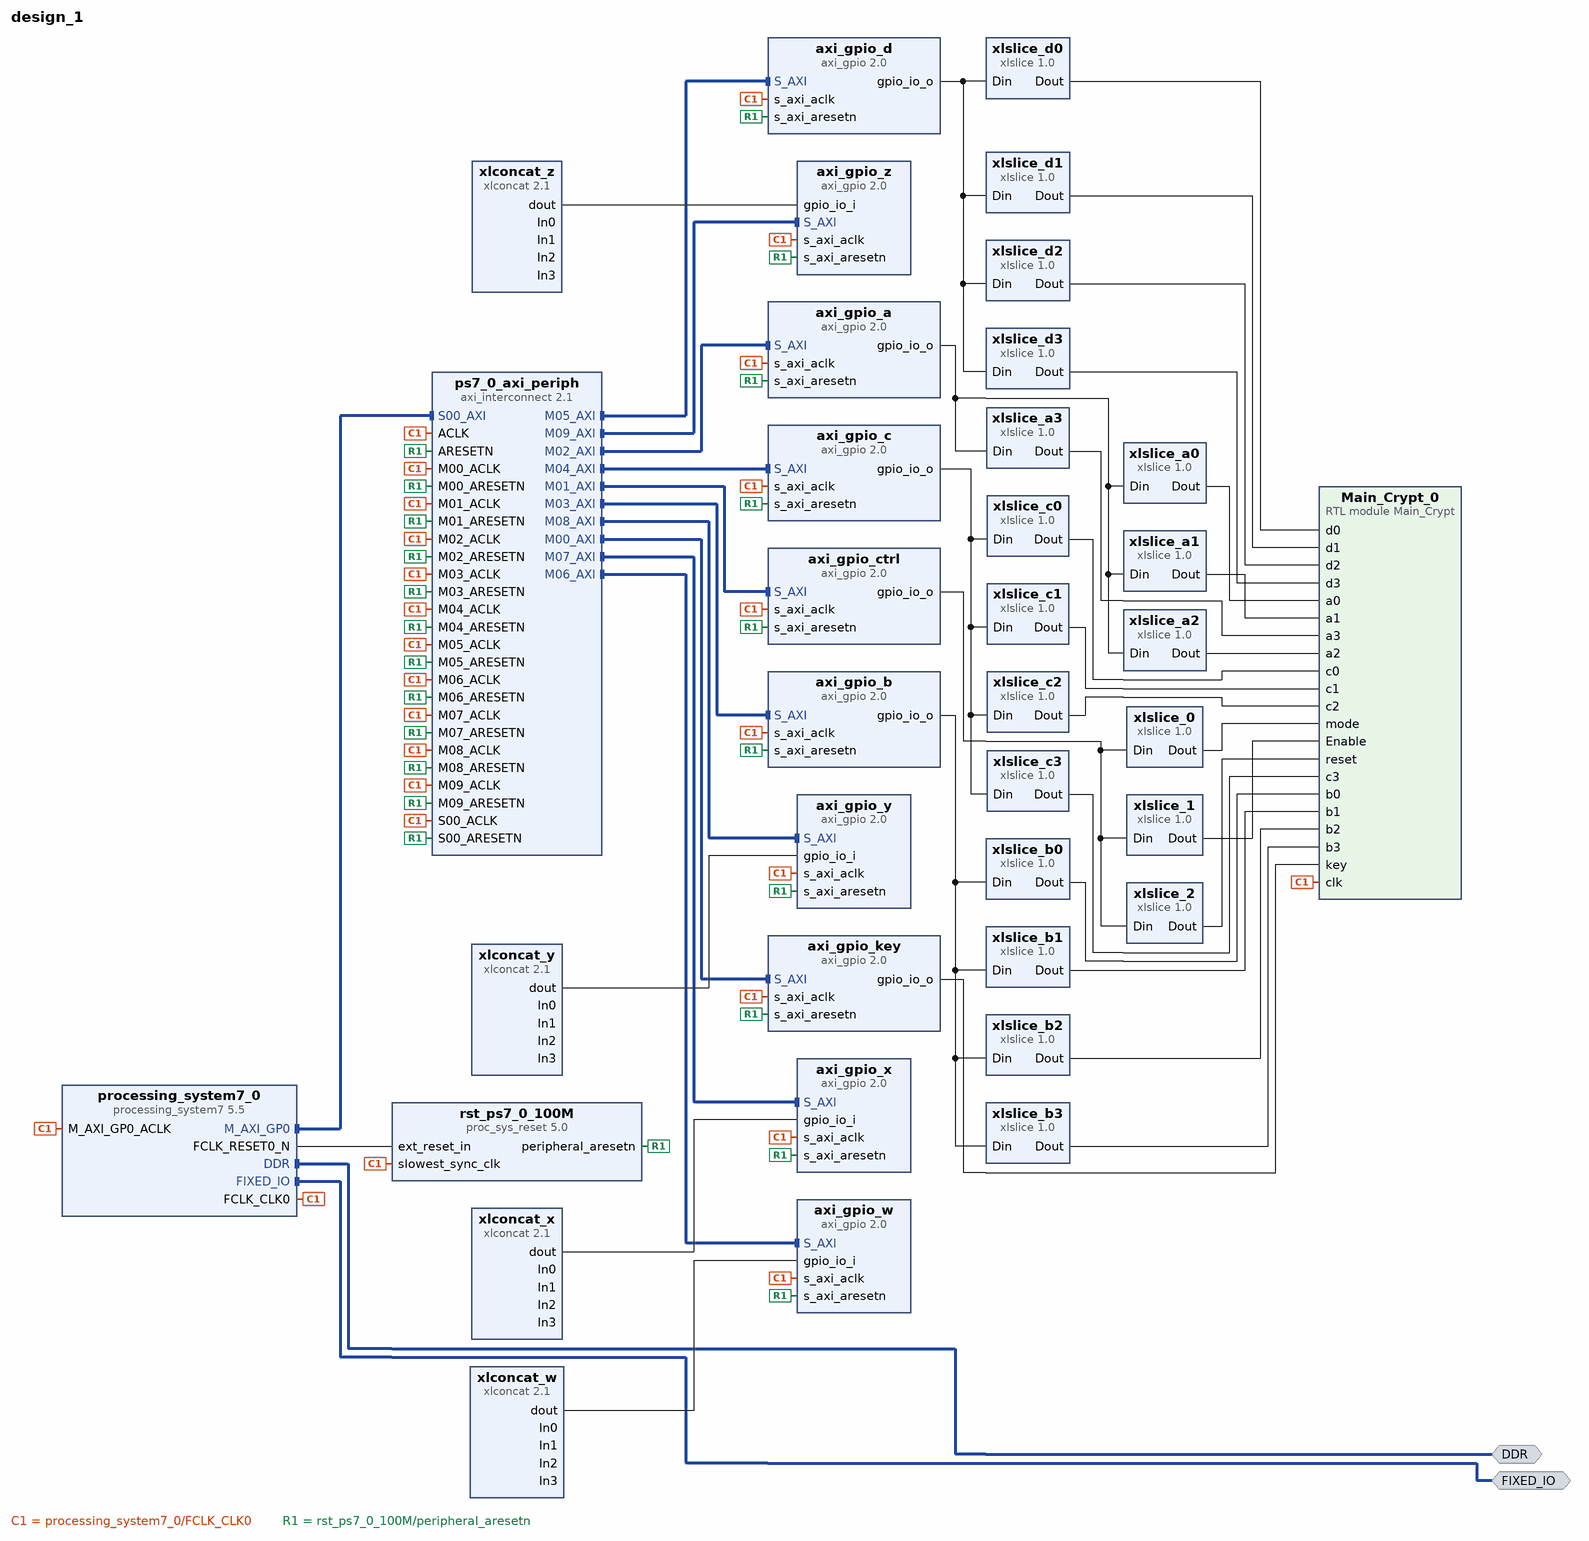
[diagram p0: block diagram of the top level]
# Vivado block design design_1, xc7z020clg400-1, Vivado 2022.1
create_bd_design design_1

create_bd_intf_port -mode Master -vlnv xilinx.com:interface:ddrx_rtl:1.0 DDR
create_bd_intf_port -mode Master -vlnv xilinx.com:display_processing_system7:fixedio_rtl:1.0 FIXED_IO

create_bd_cell -type ip -vlnv xilinx.com:ip:processing_system7:5.5 processing_system7_0
set_property -dict [list \
  CONFIG.PCW_APU_PERIPHERAL_FREQMHZ 650 \
  CONFIG.PCW_CRYSTAL_PERIPHERAL_FREQMHZ 50 \
  CONFIG.PCW_ENET0_ENET0_IO {MIO 16 .. 27} \
  CONFIG.PCW_ENET0_GRP_MDIO_ENABLE 1 \
  CONFIG.PCW_ENET0_GRP_MDIO_IO {MIO 52 .. 53} \
  CONFIG.PCW_ENET0_PERIPHERAL_ENABLE 1 \
  CONFIG.PCW_ENET0_RESET_ENABLE 1 \
  CONFIG.PCW_ENET0_RESET_IO {MIO 9} \
  CONFIG.PCW_ENET_RESET_ENABLE 1 \
  CONFIG.PCW_ENET_RESET_SELECT {Share reset pin} \
  CONFIG.PCW_FPGA0_PERIPHERAL_FREQMHZ 150 \
  CONFIG.PCW_FPGA1_PERIPHERAL_FREQMHZ 50 \
  CONFIG.PCW_GPIO_EMIO_GPIO_ENABLE 1 \
  CONFIG.PCW_GPIO_EMIO_GPIO_IO 29 \
  CONFIG.PCW_GPIO_EMIO_GPIO_WIDTH 29 \
  CONFIG.PCW_GPIO_MIO_GPIO_ENABLE 1 \
  CONFIG.PCW_GPIO_MIO_GPIO_IO MIO \
  CONFIG.PCW_I2C_RESET_ENABLE 1 \
  CONFIG.PCW_M_AXI_GP0_FREQMHZ 10 \
  CONFIG.PCW_PERIPHERAL_BOARD_PRESET part0 \
  CONFIG.PCW_PRESET_BANK1_VOLTAGE {LVCMOS 1.8V} \
  CONFIG.PCW_QSPI_GRP_FBCLK_ENABLE 1 \
  CONFIG.PCW_QSPI_GRP_FBCLK_IO {MIO 8} \
  CONFIG.PCW_QSPI_GRP_SINGLE_SS_ENABLE 1 \
  CONFIG.PCW_QSPI_GRP_SINGLE_SS_IO {MIO 1 .. 6} \
  CONFIG.PCW_QSPI_PERIPHERAL_ENABLE 1 \
  CONFIG.PCW_QSPI_QSPI_IO {MIO 1 .. 6} \
  CONFIG.PCW_SD0_GRP_CD_ENABLE 1 \
  CONFIG.PCW_SD0_GRP_CD_IO {MIO 47} \
  CONFIG.PCW_SD0_GRP_WP_ENABLE 0 \
  CONFIG.PCW_SD0_PERIPHERAL_ENABLE 1 \
  CONFIG.PCW_SD0_SD0_IO {MIO 40 .. 45} \
  CONFIG.PCW_SDIO_PERIPHERAL_FREQMHZ 50 \
  CONFIG.PCW_SINGLE_QSPI_DATA_MODE x4 \
  CONFIG.PCW_UART0_PERIPHERAL_ENABLE 1 \
  CONFIG.PCW_UART0_UART0_IO {MIO 14 .. 15} \
  CONFIG.PCW_UART1_PERIPHERAL_ENABLE 0 \
  CONFIG.PCW_UART_PERIPHERAL_FREQMHZ 100 \
  CONFIG.PCW_UIPARAM_DDR_BUS_WIDTH {16 Bit} \
  CONFIG.PCW_UIPARAM_DDR_FREQ_MHZ 525 \
  CONFIG.PCW_UIPARAM_DDR_PARTNO {MT41J256M16 RE-125} \
  CONFIG.PCW_USB0_PERIPHERAL_ENABLE 1 \
  CONFIG.PCW_USB0_RESET_ENABLE 1 \
  CONFIG.PCW_USB0_RESET_IO {MIO 46} \
  CONFIG.PCW_USB0_USB0_IO {MIO 28 .. 39} \
  CONFIG.PCW_USB_RESET_ENABLE 1 \
  CONFIG.PCW_USB_RESET_SELECT {Share reset pin} \
] [get_bd_cells processing_system7_0]
# 485 more settings of processing_system7_0 are not shown: defaults, MIO pin electricals, DDR timing, and values the tool derives
create_bd_cell -type ip -vlnv xilinx.com:ip:proc_sys_reset:5.0 rst_ps7_0_100M
create_bd_cell -type ip -vlnv xilinx.com:ip:axi_gpio:2.0 axi_gpio_key
set_property -dict [list \
  CONFIG.C_ALL_OUTPUTS 1 \
  CONFIG.C_GPIO_WIDTH 10 \
  CONFIG.GPIO_BOARD_INTERFACE Custom \
  CONFIG.USE_BOARD_FLOW true \
] [get_bd_cells axi_gpio_key]
create_bd_cell -type ip -vlnv xilinx.com:ip:axi_interconnect:2.1 ps7_0_axi_periph
set_property -dict {CONFIG.NUM_MI 10} [get_bd_cells ps7_0_axi_periph]
create_bd_cell -type ip -vlnv xilinx.com:ip:axi_gpio:2.0 axi_gpio_ctrl
set_property -dict {CONFIG.C_ALL_INPUTS 0 CONFIG.C_ALL_OUTPUTS 1 CONFIG.C_GPIO_WIDTH 3} [get_bd_cells axi_gpio_ctrl]
create_bd_cell -type ip -vlnv xilinx.com:ip:xlslice:1.0 xlslice_0
set_property -dict {CONFIG.DIN_FROM 2 CONFIG.DIN_TO 2 CONFIG.DIN_WIDTH 3 CONFIG.DOUT_WIDTH 1} [get_bd_cells xlslice_0]
create_bd_cell -type ip -vlnv xilinx.com:ip:xlslice:1.0 xlslice_1
set_property -dict {CONFIG.DIN_FROM 1 CONFIG.DIN_TO 1 CONFIG.DIN_WIDTH 3 CONFIG.DOUT_WIDTH 1} [get_bd_cells xlslice_1]
create_bd_cell -type ip -vlnv xilinx.com:ip:xlslice:1.0 xlslice_2
set_property -dict {CONFIG.DIN_FROM 0 CONFIG.DIN_TO 0 CONFIG.DIN_WIDTH 3 CONFIG.DOUT_WIDTH 1} [get_bd_cells xlslice_2]
create_bd_cell -type ip -vlnv xilinx.com:ip:axi_gpio:2.0 axi_gpio_a
set_property -dict {CONFIG.C_ALL_OUTPUTS 1} [get_bd_cells axi_gpio_a]
create_bd_cell -type ip -vlnv xilinx.com:ip:xlslice:1.0 xlslice_a0
set_property -dict {CONFIG.DIN_FROM 31 CONFIG.DIN_TO 24 CONFIG.DIN_WIDTH 32 CONFIG.DOUT_WIDTH 8} [get_bd_cells xlslice_a0]
create_bd_cell -type ip -vlnv xilinx.com:ip:xlslice:1.0 xlslice_a1
set_property -dict {CONFIG.DIN_FROM 23 CONFIG.DIN_TO 16 CONFIG.DIN_WIDTH 32 CONFIG.DOUT_WIDTH 8} [get_bd_cells xlslice_a1]
create_bd_cell -type ip -vlnv xilinx.com:ip:xlslice:1.0 xlslice_a2
set_property -dict {CONFIG.DIN_FROM 15 CONFIG.DIN_TO 8 CONFIG.DIN_WIDTH 32 CONFIG.DOUT_WIDTH 8} [get_bd_cells xlslice_a2]
create_bd_cell -type ip -vlnv xilinx.com:ip:xlslice:1.0 xlslice_a3
set_property -dict {CONFIG.DIN_FROM 7 CONFIG.DIN_WIDTH 32 CONFIG.DOUT_WIDTH 8} [get_bd_cells xlslice_a3]
create_bd_cell -type ip -vlnv xilinx.com:ip:axi_gpio:2.0 axi_gpio_b
set_property -dict {CONFIG.C_ALL_OUTPUTS 1} [get_bd_cells axi_gpio_b]
create_bd_cell -type ip -vlnv xilinx.com:ip:xlslice:1.0 xlslice_b3
set_property -dict {CONFIG.DIN_FROM 31 CONFIG.DIN_TO 24 CONFIG.DIN_WIDTH 32 CONFIG.DOUT_WIDTH 8} [get_bd_cells xlslice_b3]
create_bd_cell -type ip -vlnv xilinx.com:ip:xlslice:1.0 xlslice_b0
set_property -dict {CONFIG.DIN_FROM 23 CONFIG.DIN_TO 16 CONFIG.DIN_WIDTH 32 CONFIG.DOUT_WIDTH 8} [get_bd_cells xlslice_b0]
create_bd_cell -type ip -vlnv xilinx.com:ip:xlslice:1.0 xlslice_b2
set_property -dict {CONFIG.DIN_FROM 15 CONFIG.DIN_TO 8 CONFIG.DIN_WIDTH 32 CONFIG.DOUT_WIDTH 8} [get_bd_cells xlslice_b2]
create_bd_cell -type ip -vlnv xilinx.com:ip:xlslice:1.0 xlslice_b1
set_property -dict {CONFIG.DIN_FROM 7 CONFIG.DIN_WIDTH 32 CONFIG.DOUT_WIDTH 8} [get_bd_cells xlslice_b1]
create_bd_cell -type ip -vlnv xilinx.com:ip:axi_gpio:2.0 axi_gpio_c
set_property -dict {CONFIG.C_ALL_OUTPUTS 1} [get_bd_cells axi_gpio_c]
create_bd_cell -type ip -vlnv xilinx.com:ip:xlslice:1.0 xlslice_c3
set_property -dict {CONFIG.DIN_FROM 31 CONFIG.DIN_TO 24 CONFIG.DIN_WIDTH 32 CONFIG.DOUT_WIDTH 8} [get_bd_cells xlslice_c3]
create_bd_cell -type ip -vlnv xilinx.com:ip:xlslice:1.0 xlslice_c0
set_property -dict {CONFIG.DIN_FROM 23 CONFIG.DIN_TO 16 CONFIG.DIN_WIDTH 32 CONFIG.DOUT_WIDTH 8} [get_bd_cells xlslice_c0]
create_bd_cell -type ip -vlnv xilinx.com:ip:xlslice:1.0 xlslice_c2
set_property -dict {CONFIG.DIN_FROM 15 CONFIG.DIN_TO 8 CONFIG.DIN_WIDTH 32 CONFIG.DOUT_WIDTH 8} [get_bd_cells xlslice_c2]
create_bd_cell -type ip -vlnv xilinx.com:ip:xlslice:1.0 xlslice_c1
set_property -dict {CONFIG.DIN_FROM 7 CONFIG.DIN_WIDTH 32 CONFIG.DOUT_WIDTH 8} [get_bd_cells xlslice_c1]
create_bd_cell -type ip -vlnv xilinx.com:ip:axi_gpio:2.0 axi_gpio_d
set_property -dict {CONFIG.C_ALL_OUTPUTS 1} [get_bd_cells axi_gpio_d]
create_bd_cell -type ip -vlnv xilinx.com:ip:xlslice:1.0 xlslice_d0
set_property -dict {CONFIG.DIN_FROM 31 CONFIG.DIN_TO 24 CONFIG.DIN_WIDTH 32 CONFIG.DOUT_WIDTH 8} [get_bd_cells xlslice_d0]
create_bd_cell -type ip -vlnv xilinx.com:ip:xlslice:1.0 xlslice_d3
set_property -dict {CONFIG.DIN_FROM 23 CONFIG.DIN_TO 16 CONFIG.DIN_WIDTH 32 CONFIG.DOUT_WIDTH 8} [get_bd_cells xlslice_d3]
create_bd_cell -type ip -vlnv xilinx.com:ip:xlslice:1.0 xlslice_d2
set_property -dict {CONFIG.DIN_FROM 15 CONFIG.DIN_TO 8 CONFIG.DIN_WIDTH 32 CONFIG.DOUT_WIDTH 8} [get_bd_cells xlslice_d2]
create_bd_cell -type ip -vlnv xilinx.com:ip:xlslice:1.0 xlslice_d1
set_property -dict {CONFIG.DIN_FROM 7 CONFIG.DIN_WIDTH 32 CONFIG.DOUT_WIDTH 8} [get_bd_cells xlslice_d1]
create_bd_cell -type ip -vlnv xilinx.com:ip:axi_gpio:2.0 axi_gpio_w
set_property -dict {CONFIG.C_ALL_INPUTS 1} [get_bd_cells axi_gpio_w]
create_bd_cell -type ip -vlnv xilinx.com:ip:xlconcat:2.1 xlconcat_w
set_property -dict [list \
  CONFIG.IN0_WIDTH 8 \
  CONFIG.IN1_WIDTH 8 \
  CONFIG.IN2_WIDTH 8 \
  CONFIG.IN3_WIDTH 8 \
  CONFIG.NUM_PORTS 4 \
] [get_bd_cells xlconcat_w]
create_bd_cell -type ip -vlnv xilinx.com:ip:xlconcat:2.1 xlconcat_x
set_property -dict [list \
  CONFIG.IN0_WIDTH 8 \
  CONFIG.IN1_WIDTH 8 \
  CONFIG.IN2_WIDTH 8 \
  CONFIG.IN3_WIDTH 8 \
  CONFIG.NUM_PORTS 4 \
] [get_bd_cells xlconcat_x]
create_bd_cell -type ip -vlnv xilinx.com:ip:xlconcat:2.1 xlconcat_y
set_property -dict [list \
  CONFIG.IN0_WIDTH 8 \
  CONFIG.IN1_WIDTH 8 \
  CONFIG.IN2_WIDTH 8 \
  CONFIG.IN3_WIDTH 8 \
  CONFIG.NUM_PORTS 4 \
] [get_bd_cells xlconcat_y]
create_bd_cell -type ip -vlnv xilinx.com:ip:xlconcat:2.1 xlconcat_z
set_property -dict [list \
  CONFIG.IN0_WIDTH 8 \
  CONFIG.IN1_WIDTH 8 \
  CONFIG.IN2_WIDTH 8 \
  CONFIG.IN3_WIDTH 8 \
  CONFIG.NUM_PORTS 4 \
] [get_bd_cells xlconcat_z]
create_bd_cell -type ip -vlnv xilinx.com:ip:axi_gpio:2.0 axi_gpio_x
set_property -dict {CONFIG.C_ALL_INPUTS 1} [get_bd_cells axi_gpio_x]
create_bd_cell -type ip -vlnv xilinx.com:ip:axi_gpio:2.0 axi_gpio_y
set_property -dict {CONFIG.C_ALL_INPUTS 1} [get_bd_cells axi_gpio_y]
create_bd_cell -type ip -vlnv xilinx.com:ip:axi_gpio:2.0 axi_gpio_z
set_property -dict {CONFIG.C_ALL_INPUTS 1} [get_bd_cells axi_gpio_z]
create_bd_cell -type module -reference Main_Crypt Main_Crypt_0

# ---- connections ----

connect_bd_intf_net [get_bd_intf_ports DDR] [get_bd_intf_pins processing_system7_0/DDR]
connect_bd_intf_net [get_bd_intf_ports FIXED_IO] [get_bd_intf_pins processing_system7_0/FIXED_IO]
connect_bd_intf_net [get_bd_intf_pins processing_system7_0/M_AXI_GP0] [get_bd_intf_pins ps7_0_axi_periph/S00_AXI]
connect_bd_intf_net [get_bd_intf_pins ps7_0_axi_periph/M00_AXI] [get_bd_intf_pins axi_gpio_key/S_AXI]
connect_bd_intf_net [get_bd_intf_pins ps7_0_axi_periph/M01_AXI] [get_bd_intf_pins axi_gpio_ctrl/S_AXI]
connect_bd_intf_net [get_bd_intf_pins ps7_0_axi_periph/M02_AXI] [get_bd_intf_pins axi_gpio_a/S_AXI]
connect_bd_intf_net [get_bd_intf_pins ps7_0_axi_periph/M03_AXI] [get_bd_intf_pins axi_gpio_b/S_AXI]
connect_bd_intf_net [get_bd_intf_pins ps7_0_axi_periph/M04_AXI] [get_bd_intf_pins axi_gpio_c/S_AXI]
connect_bd_intf_net [get_bd_intf_pins ps7_0_axi_periph/M05_AXI] [get_bd_intf_pins axi_gpio_d/S_AXI]
connect_bd_intf_net [get_bd_intf_pins ps7_0_axi_periph/M06_AXI] [get_bd_intf_pins axi_gpio_w/S_AXI]
connect_bd_intf_net [get_bd_intf_pins ps7_0_axi_periph/M07_AXI] [get_bd_intf_pins axi_gpio_x/S_AXI]
connect_bd_intf_net [get_bd_intf_pins ps7_0_axi_periph/M08_AXI] [get_bd_intf_pins axi_gpio_y/S_AXI]
connect_bd_intf_net [get_bd_intf_pins ps7_0_axi_periph/M09_AXI] [get_bd_intf_pins axi_gpio_z/S_AXI]
# net Main_Crypt_0_w0 has one end: xlconcat_w/In0
# net Main_Crypt_0_w1 has one end: xlconcat_w/In1
# net Main_Crypt_0_w2 has one end: xlconcat_w/In2
# net Main_Crypt_0_w3 has one end: xlconcat_w/In3
# net Main_Crypt_0_x0 has one end: xlconcat_x/In0
# net Main_Crypt_0_x1 has one end: xlconcat_x/In1
# net Main_Crypt_0_x2 has one end: xlconcat_x/In2
# net Main_Crypt_0_x3 has one end: xlconcat_x/In3
# net Main_Crypt_0_y0 has one end: xlconcat_y/In0
# net Main_Crypt_0_y1 has one end: xlconcat_y/In1
# net Main_Crypt_0_y2 has one end: xlconcat_y/In2
# net Main_Crypt_0_y3 has one end: xlconcat_y/In3
# net Main_Crypt_0_z0 has one end: xlconcat_z/In0
# net Main_Crypt_0_z1 has one end: xlconcat_z/In1
# net Main_Crypt_0_z2 has one end: xlconcat_z/In2
# net Main_Crypt_0_z3 has one end: xlconcat_z/In3
connect_bd_net [get_bd_pins axi_gpio_a/gpio_io_o] \
  [get_bd_pins xlslice_a0/Din] [get_bd_pins xlslice_a1/Din] [get_bd_pins xlslice_a2/Din] [get_bd_pins xlslice_a3/Din]
connect_bd_net [get_bd_pins axi_gpio_b/gpio_io_o] \
  [get_bd_pins xlslice_b0/Din] [get_bd_pins xlslice_b1/Din] [get_bd_pins xlslice_b2/Din] [get_bd_pins xlslice_b3/Din]
connect_bd_net [get_bd_pins axi_gpio_c/gpio_io_o] \
  [get_bd_pins xlslice_c0/Din] [get_bd_pins xlslice_c1/Din] [get_bd_pins xlslice_c2/Din] [get_bd_pins xlslice_c3/Din]
connect_bd_net [get_bd_pins axi_gpio_ctrl/gpio_io_o] [get_bd_pins xlslice_0/Din] [get_bd_pins xlslice_1/Din] [get_bd_pins xlslice_2/Din]
connect_bd_net [get_bd_pins axi_gpio_d/gpio_io_o] \
  [get_bd_pins xlslice_d0/Din] [get_bd_pins xlslice_d3/Din] [get_bd_pins xlslice_d1/Din] [get_bd_pins xlslice_d2/Din]
connect_bd_net [get_bd_pins axi_gpio_key/gpio_io_o] [get_bd_pins Main_Crypt_0/key]
connect_bd_net [get_bd_pins processing_system7_0/FCLK_CLK0] \
  [get_bd_pins axi_gpio_a/s_axi_aclk] [get_bd_pins ps7_0_axi_periph/M02_ACLK] [get_bd_pins axi_gpio_b/s_axi_aclk] \
  [get_bd_pins ps7_0_axi_periph/M03_ACLK] [get_bd_pins axi_gpio_c/s_axi_aclk] [get_bd_pins ps7_0_axi_periph/M04_ACLK] \
  [get_bd_pins axi_gpio_ctrl/s_axi_aclk] [get_bd_pins ps7_0_axi_periph/M01_ACLK] [get_bd_pins axi_gpio_d/s_axi_aclk] \
  [get_bd_pins ps7_0_axi_periph/M05_ACLK] [get_bd_pins axi_gpio_key/s_axi_aclk] [get_bd_pins ps7_0_axi_periph/M00_ACLK] \
  [get_bd_pins axi_gpio_w/s_axi_aclk] [get_bd_pins ps7_0_axi_periph/M06_ACLK] [get_bd_pins axi_gpio_x/s_axi_aclk] \
  [get_bd_pins ps7_0_axi_periph/M07_ACLK] [get_bd_pins axi_gpio_y/s_axi_aclk] [get_bd_pins ps7_0_axi_periph/M08_ACLK] \
  [get_bd_pins axi_gpio_z/s_axi_aclk] [get_bd_pins ps7_0_axi_periph/M09_ACLK] \
  [get_bd_pins processing_system7_0/M_AXI_GP0_ACLK] [get_bd_pins ps7_0_axi_periph/S00_ACLK] \
  [get_bd_pins ps7_0_axi_periph/ACLK] [get_bd_pins rst_ps7_0_100M/slowest_sync_clk] [get_bd_pins Main_Crypt_0/clk]
connect_bd_net [get_bd_pins processing_system7_0/FCLK_RESET0_N] [get_bd_pins rst_ps7_0_100M/ext_reset_in]
connect_bd_net [get_bd_pins rst_ps7_0_100M/peripheral_aresetn] \
  [get_bd_pins ps7_0_axi_periph/S00_ARESETN] [get_bd_pins axi_gpio_key/s_axi_aresetn] \
  [get_bd_pins ps7_0_axi_periph/M00_ARESETN] [get_bd_pins ps7_0_axi_periph/ARESETN] \
  [get_bd_pins ps7_0_axi_periph/M01_ARESETN] [get_bd_pins axi_gpio_ctrl/s_axi_aresetn] \
  [get_bd_pins ps7_0_axi_periph/M02_ARESETN] [get_bd_pins axi_gpio_a/s_axi_aresetn] [get_bd_pins axi_gpio_b/s_axi_aresetn] \
  [get_bd_pins ps7_0_axi_periph/M03_ARESETN] [get_bd_pins axi_gpio_c/s_axi_aresetn] \
  [get_bd_pins ps7_0_axi_periph/M04_ARESETN] [get_bd_pins axi_gpio_d/s_axi_aresetn] \
  [get_bd_pins ps7_0_axi_periph/M05_ARESETN] [get_bd_pins axi_gpio_w/s_axi_aresetn] \
  [get_bd_pins ps7_0_axi_periph/M06_ARESETN] [get_bd_pins axi_gpio_x/s_axi_aresetn] \
  [get_bd_pins ps7_0_axi_periph/M07_ARESETN] [get_bd_pins axi_gpio_y/s_axi_aresetn] \
  [get_bd_pins ps7_0_axi_periph/M08_ARESETN] [get_bd_pins axi_gpio_z/s_axi_aresetn] \
  [get_bd_pins ps7_0_axi_periph/M09_ARESETN]
connect_bd_net [get_bd_pins xlconcat_w/dout] [get_bd_pins axi_gpio_w/gpio_io_i]
connect_bd_net [get_bd_pins xlconcat_x/dout] [get_bd_pins axi_gpio_x/gpio_io_i]
connect_bd_net [get_bd_pins xlconcat_y/dout] [get_bd_pins axi_gpio_y/gpio_io_i]
connect_bd_net [get_bd_pins xlconcat_z/dout] [get_bd_pins axi_gpio_z/gpio_io_i]
connect_bd_net [get_bd_pins xlslice_0/Dout] [get_bd_pins Main_Crypt_0/mode]
connect_bd_net [get_bd_pins xlslice_1/Dout] [get_bd_pins Main_Crypt_0/Enable]
connect_bd_net [get_bd_pins xlslice_2/Dout] [get_bd_pins Main_Crypt_0/reset]
connect_bd_net [get_bd_pins xlslice_a0/Dout] [get_bd_pins Main_Crypt_0/a0]
connect_bd_net [get_bd_pins xlslice_a1/Dout] [get_bd_pins Main_Crypt_0/a1]
connect_bd_net [get_bd_pins xlslice_a2/Dout] [get_bd_pins Main_Crypt_0/a2]
connect_bd_net [get_bd_pins xlslice_a3/Dout] [get_bd_pins Main_Crypt_0/a3]
connect_bd_net [get_bd_pins xlslice_b0/Dout] [get_bd_pins Main_Crypt_0/b0]
connect_bd_net [get_bd_pins xlslice_b1/Dout] [get_bd_pins Main_Crypt_0/b1]
connect_bd_net [get_bd_pins xlslice_b2/Dout] [get_bd_pins Main_Crypt_0/b2]
connect_bd_net [get_bd_pins xlslice_b3/Dout] [get_bd_pins Main_Crypt_0/b3]
connect_bd_net [get_bd_pins xlslice_c0/Dout] [get_bd_pins Main_Crypt_0/c0]
connect_bd_net [get_bd_pins xlslice_c1/Dout] [get_bd_pins Main_Crypt_0/c1]
connect_bd_net [get_bd_pins xlslice_c2/Dout] [get_bd_pins Main_Crypt_0/c2]
connect_bd_net [get_bd_pins xlslice_c3/Dout] [get_bd_pins Main_Crypt_0/c3]
connect_bd_net [get_bd_pins xlslice_d0/Dout] [get_bd_pins Main_Crypt_0/d0]
connect_bd_net [get_bd_pins xlslice_d1/Dout] [get_bd_pins Main_Crypt_0/d1]
connect_bd_net [get_bd_pins xlslice_d2/Dout] [get_bd_pins Main_Crypt_0/d2]
connect_bd_net [get_bd_pins xlslice_d3/Dout] [get_bd_pins Main_Crypt_0/d3]

# ---- address map ----
assign_bd_address -offset 0x41200000 -range 64K -target_address_space [get_bd_addr_spaces processing_system7_0/Data] [get_bd_addr_segs axi_gpio_key/S_AXI/Reg]
assign_bd_address -offset 0x41210000 -range 64K -target_address_space [get_bd_addr_spaces processing_system7_0/Data] [get_bd_addr_segs axi_gpio_ctrl/S_AXI/Reg]
assign_bd_address -offset 0x41220000 -range 64K -target_address_space [get_bd_addr_spaces processing_system7_0/Data] [get_bd_addr_segs axi_gpio_a/S_AXI/Reg]
assign_bd_address -offset 0x41230000 -range 64K -target_address_space [get_bd_addr_spaces processing_system7_0/Data] [get_bd_addr_segs axi_gpio_b/S_AXI/Reg]
assign_bd_address -offset 0x41240000 -range 64K -target_address_space [get_bd_addr_spaces processing_system7_0/Data] [get_bd_addr_segs axi_gpio_c/S_AXI/Reg]
assign_bd_address -offset 0x41250000 -range 64K -target_address_space [get_bd_addr_spaces processing_system7_0/Data] [get_bd_addr_segs axi_gpio_d/S_AXI/Reg]
assign_bd_address -offset 0x41260000 -range 64K -target_address_space [get_bd_addr_spaces processing_system7_0/Data] [get_bd_addr_segs axi_gpio_w/S_AXI/Reg]
assign_bd_address -offset 0x41270000 -range 64K -target_address_space [get_bd_addr_spaces processing_system7_0/Data] [get_bd_addr_segs axi_gpio_x/S_AXI/Reg]
assign_bd_address -offset 0x41280000 -range 64K -target_address_space [get_bd_addr_spaces processing_system7_0/Data] [get_bd_addr_segs axi_gpio_y/S_AXI/Reg]
assign_bd_address -offset 0x41290000 -range 64K -target_address_space [get_bd_addr_spaces processing_system7_0/Data] [get_bd_addr_segs axi_gpio_z/S_AXI/Reg]

validate_bd_design
save_bd_design
